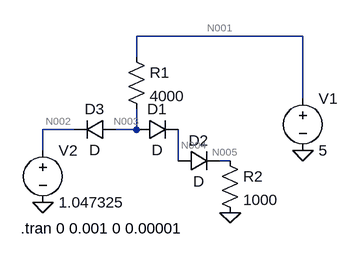
[diagram p0: schematic DIode_model.asc]
DIode_model.asc, the LTspice schematic file:
Version 4
SHEET 1 880 680
WIRE 416 0 160 0
WIRE 160 32 160 0
WIRE 416 96 416 0
WIRE 64 144 16 144
WIRE 160 144 160 112
WIRE 160 144 128 144
WIRE 16 176 16 144
WIRE 224 192 224 144
WIRE 304 192 288 192
FLAG 16 256 0
FLAG 416 176 0
FLAG 304 272 0
SYMBOL res 144 16 R0
SYMATTR InstName R1
SYMATTR Value 4000
SYMBOL res 288 176 R0
SYMATTR InstName R2
SYMATTR Value 1000
SYMBOL diode 160 160 R270
WINDOW 0 32 32 VTop 2
WINDOW 3 0 32 VBottom 2
SYMATTR InstName D1
SYMBOL diode 224 208 R270
WINDOW 0 32 32 VTop 2
WINDOW 3 0 32 VBottom 2
SYMATTR InstName D2
SYMBOL diode 128 128 R90
WINDOW 0 0 32 VBottom 2
WINDOW 3 32 32 VTop 2
SYMATTR InstName D3
SYMBOL voltage 416 80 R0
WINDOW 123 0 0 Left 2
WINDOW 39 0 0 Left 2
SYMATTR InstName V1
SYMATTR Value 5
SYMBOL voltage 16 160 R0
WINDOW 123 0 0 Left 2
WINDOW 39 0 0 Left 2
SYMATTR InstName V2
SYMATTR Value 1.047325
TEXT -18 296 Left 2 !.tran 0 0.001 0 0.00001

The netlist it stands for:
* DIode_model.asc
R1 N001 N003 4000
R2 N005 0 1000
D1 N003 N004 D
D2 N004 N005 D
D3 N003 N002 D
V1 N001 0 5
V2 N002 0 1.047325
.model D D
.lib standard.dio
.tran 0 0.001 0 0.00001
.backanno
.end

* Results of the author's LTspice run, read from the files saved beside the schematic
* Operating Point, zero values left out:
*   V(n001) = 5 V
*   V(n003) = 1.68 V
*   V(n005) = 415 mV
*   V(n004) = 1.047 V
*   V(n002) = 1.047 V
*   I(D3) = 415.1 µA
*   I(D2) = 415 µA
*   I(D1) = 415 µA
*   I(R2) = 415 µA
*   I(R1) = 830.1 µA
*   I(V2) = 415.1 µA
*   I(V1) = -830.1 µA
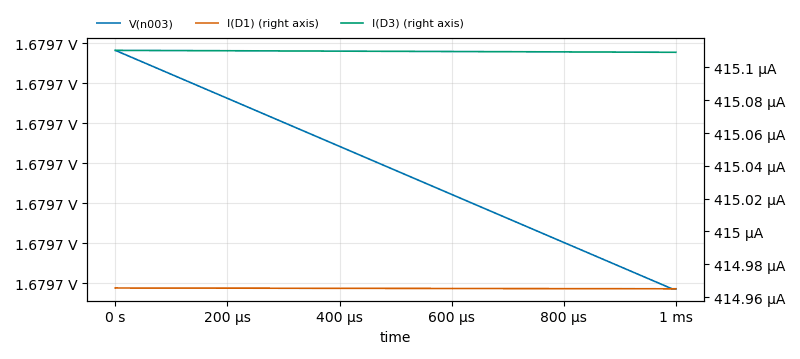
[diagram p1: Transient Analysis of DIode_model.asc, plotted from the saved traces]
* Transient Analysis, 1 run:
*   V(n003): min 1.68 V, max 1.68 V, average 1.68 V, rms 1.68 V, last 1.68 V
*   I(D1): min 415 µA, max 415 µA, average 415 µA, rms 415 µA, last 415 µA
*   I(D3): min 415.1 µA, max 415.1 µA, average 415.1 µA, rms 415.1 µA, last 415.1 µA